# EAGLE design FotoMindARShield (EAGLE 6.3)
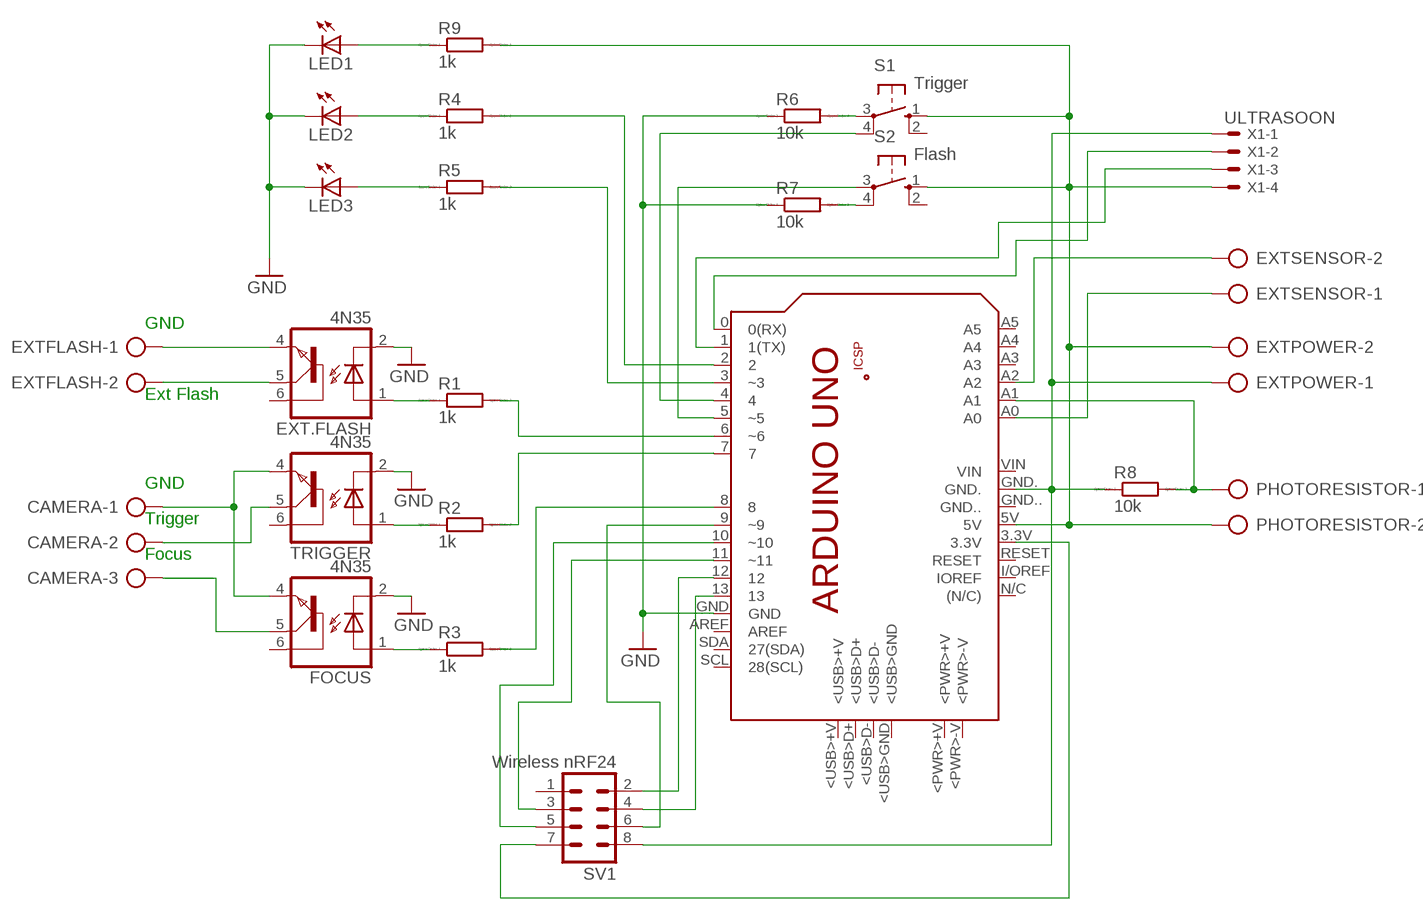
[diagram p0: schematic, sheet 1]

## Parts
CAMERA  AK300/3  [AK300/3]
EXT.FLASH  4N35  [DIL06]
EXTFLASH  AK300/2  [AK300/2]
EXTPOWER  AK300/2  [AK300/2]
EXTSENSOR  AK300/2  [AK300/2]
FOCUS  4N35  [DIL06]
LED1  LED3MM  [LED3MM]
LED2  LED3MM  [LED3MM]
LED3  LED3MM  [LED3MM]
PCB1  ARDUINO_UNO  [ARDUINO_UNO]
PHOTORESISTOR  AK300/2  [AK300/2]
R1  1k  R0204/7  [0204/7]
R2  1k  R0204/7  [0204/7]
R3  1k  R0204/7  [0204/7]
R4  1k  R0204/7  [0204/7]
R5  1k  R0204/7  [0204/7]
R6  10k  R0204/7  [0204/7]
R7  10k  R0204/7  [0204/7]
R8  10k  R0204/7  [0204/7]
R9  1k  R0204/7  [0204/7]
S1  Trigger  10-XX  [B3F-10XX]
S2  Flash  10-XX  [B3F-10XX]
SV1  Wireless nRF24  MA04-2  [MA04-2]
TRIGGER  4N35  [DIL06]
X1  ULTRASOON  22-23-2041  [22-23-2041]

## Nets
GND: EXT.FLASH.2(C) FOCUS.2(C) LED1.K(C) LED2.K(C) LED3.K(C) PCB1.GND R6.1 R7.1 TRIGGER.2(C)
N$1: EXT.FLASH.1(A) R1.1
N$2: R2.1 TRIGGER.1(A)
N$3: FOCUS.1(A) R3.1
N$4: PCB1.6(~6) R1.2
N$5: PCB1.7 R2.2
N$6: PCB1.8 R3.2
N$7: PCB1.2 R4.2
N$8: PCB1.3(~3) R5.2
N$9: LED3.A R5.1
N$10: LED2.A R4.1
N$11: EXT.FLASH.4(EMI) EXTFLASH.1
N$12: EXT.FLASH.5(COL) EXTFLASH.2
N$13: CAMERA.1 FOCUS.4(EMI) TRIGGER.4(EMI)
N$14: CAMERA.2 TRIGGER.5(COL)
N$15: CAMERA.3 FOCUS.5(COL)
N$16: PCB1.4 S1.4(P1)
N$17: PCB1.5(~5) S2.3(P)
N$18: R6.2 S1.3(P)
N$20: R7.2 S2.4(P1)
N$21: EXTPOWER.1 PCB1.GND. R8.1 SV1.8 X1.1
N$22: PCB1.A1 PHOTORESISTOR.1 R8.2
N$23: PCB1.12 SV1.2
N$24: PCB1.11(~11) SV1.3
N$25: PCB1.13 SV1.4
N$26: PCB1.10(~10) SV1.5
N$27: PCB1.9(~9) SV1.6
N$28: EXTSENSOR.1 PCB1.A0
N$29: EXTSENSOR.2 PCB1.A2
N$30: PCB1.3.3V SV1.7
N$79: EXTPOWER.2 PCB1.5V PHOTORESISTOR.2 R9.2 S1.1(S) S2.1(S) X1.4
N$92: LED1.A R9.1
N$105: PCB1.1(1(TX)) X1.3
N$106: PCB1.0(0(RX)) X1.2
Unconnected: EXT.FLASH.6(BAS) FOCUS.6(BAS) PCB1.+5V PCB1.<PWR>+V PCB1.<PWR>-V PCB1.<USB>+V PCB1.<USB>D+ PCB1.<USB>D- PCB1.<USB>GND PCB1.A3 PCB1.A4 PCB1.A5 PCB1.AREF PCB1.GND.. PCB1.GND_ PCB1.I/OREF(IOREF) PCB1.MISO PCB1.MOSI PCB1.N/C((N/C)) PCB1.RESET PCB1.RESET. PCB1.SCK PCB1.SCL(28(SCL)) PCB1.SDA(27(SDA)) PCB1.VIN S1.2(S1) S2.2(S1) SV1.1 TRIGGER.6(BAS)

## Notes on the sheet
- GND
- Ext Flash
- GND
- Trigger
- Focus

## Library data of the parts
CAMERA = con-ptr500:AK300/3: CONNECTOR; OC_FARNELL: unknown; OC_NEWARK: unknown
EXT.FLASH FOCUS TRIGGER = optocoupler:4N35: MOTOROLA OPTO COUPLER; MF: FAIRCHILD SEMICONDUCTOR; MPN: 4N35; OC_FARNELL: 1328375; OC_NEWARK: 72K9946
EXTFLASH EXTPOWER EXTSENSOR PHOTORESISTOR = con-ptr500:AK300/2: CONNECTOR; OC_FARNELL: unknown; OC_NEWARK: unknown
LED1-LED3 = led:LED: LED OSRAM: - CHIPLED LG R971, LG N971, LY N971, LG Q971, LY Q971, LO R971, LY R971 LH N974, LH R974 LS Q976, LO Q976, LY Q976 LO Q996 - Hyper CHIPLED LW Q18S LB Q993, LB Q99A, LB R99A - SideLED LS A670, LO A670, LY A670, LG A670, LP A670 LB A673, LV A673, LT A673, LW A673 LH A674 LY A675 LS A676, LA A676, LO A676, LY A676, LW A676 LS A679, LY A679, LG A679 - Hyper Micro SIDELED® LS Y876, LA Y876, LO Y876, LY Y876 LT Y87S - SmartLED LW L88C, LW L88S LB L89C, LB L89S, LG L890 LS L89K, LO L89K, LY L89K LS L896, LA L896, LO L896, LY L896 - TOPLED LS T670, LO T670, LY T670, LG T670, LP T670 LSG T670, LSP T670, LSY T670, LOP T670, LYG T670 LG T671, LOG T671, LSG T671 LB T673, LV T673, LT T673, LW T673 LH T674 LS T676, LA T676, LO T676, LY T676, LB T676, LH T676, LSB T676, LW T676 LB T67C, LV T67C, LT T67C, LS T67K, LO T67K, LY T67K, LW E67C LS E67B, LA E67B, LO E67B, LY E67B, LB E67C, LV E67C, LT E67C LW T67C LS T679, LY T679, LG T679 LS T770, LO T770, LY T770, LG T770, LP T770 LB T773, LV T773, LT T773, LW T773 LH T774 LS E675, LA E675, LY E675, LS T675 LS T776, LA T776, LO T776, LY T776, LB T776 LHGB T686 LT T68C, LB T68C - Hyper Mini TOPLED® LB M676 - Mini TOPLED Santana® LG M470 LS M47K, LO M47K, LY M47K Source: http://www.osram.convergy.de LUXEON: - LUMILED® LXK2-PW12-R00, LXK2-PW12-S00, LXK2-PW14-U00, LXK2-PW14-V00 LXK2-PM12-R00, LXK2-PM12-S00, LXK2-PM14-U00 LXK2-PE12-Q00, LXK2-PE12-R00, LXK2-PE12-S00, LXK2-PE14-T00, LXK2-PE14-U00 LXK2-PB12-K00, LXK2-PB12-L00, LXK2-PB12-M00, LXK2-PB14-N00, LXK2-PB14-P00, LXK2-PB14-Q00 LXK2-PR12-L00, LXK2-PR12-M00, LXK2-PR14-Q00, LXK2-PR14-R00 LXK2-PD12-Q00, LXK2-PD12-R00, LXK2-PD12-S00 LXK2-PH12-R00, LXK2-PH12-S00 LXK2-PL12-P00, LXK2-PL12-Q00, LXK2-PL12-R00 Source: www.luxeon.com KINGBRIGHT: KA-3528ASYC Source: www.kingbright.com
PCB1 = E14_Arduino_published:ARDUINO_UNO: Device for representing an Arduino Uno board with a footprint in an EAGLE design. Created by Dave Young for Element14. More EAGLE documentation at: http://www.element14.com/community/community/knode/cadsoft_eagle
R1-R9 = eagle-ltspice:R: RESISTOR, European symbol; SPICEMODEL: NONE; SPICEPREFIX: R
S1 S2 = switch-omron:10-XX: OMRON SWITCH; MPN: B3F-1000; OC_FARNELL: 176432; OC_NEWARK: 36M3542
SV1 = con-lstb:MA04-2: PIN HEADER; OC_FARNELL: unknown; OC_NEWARK: unknown
X1 = con-molex:22-23-2041: .100" (2.54mm) Center Header - 4 Pin; MF: MOLEX; MPN: 22-23-2041; OC_FARNELL: 1462920; OC_NEWARK: 38C0355

## Board
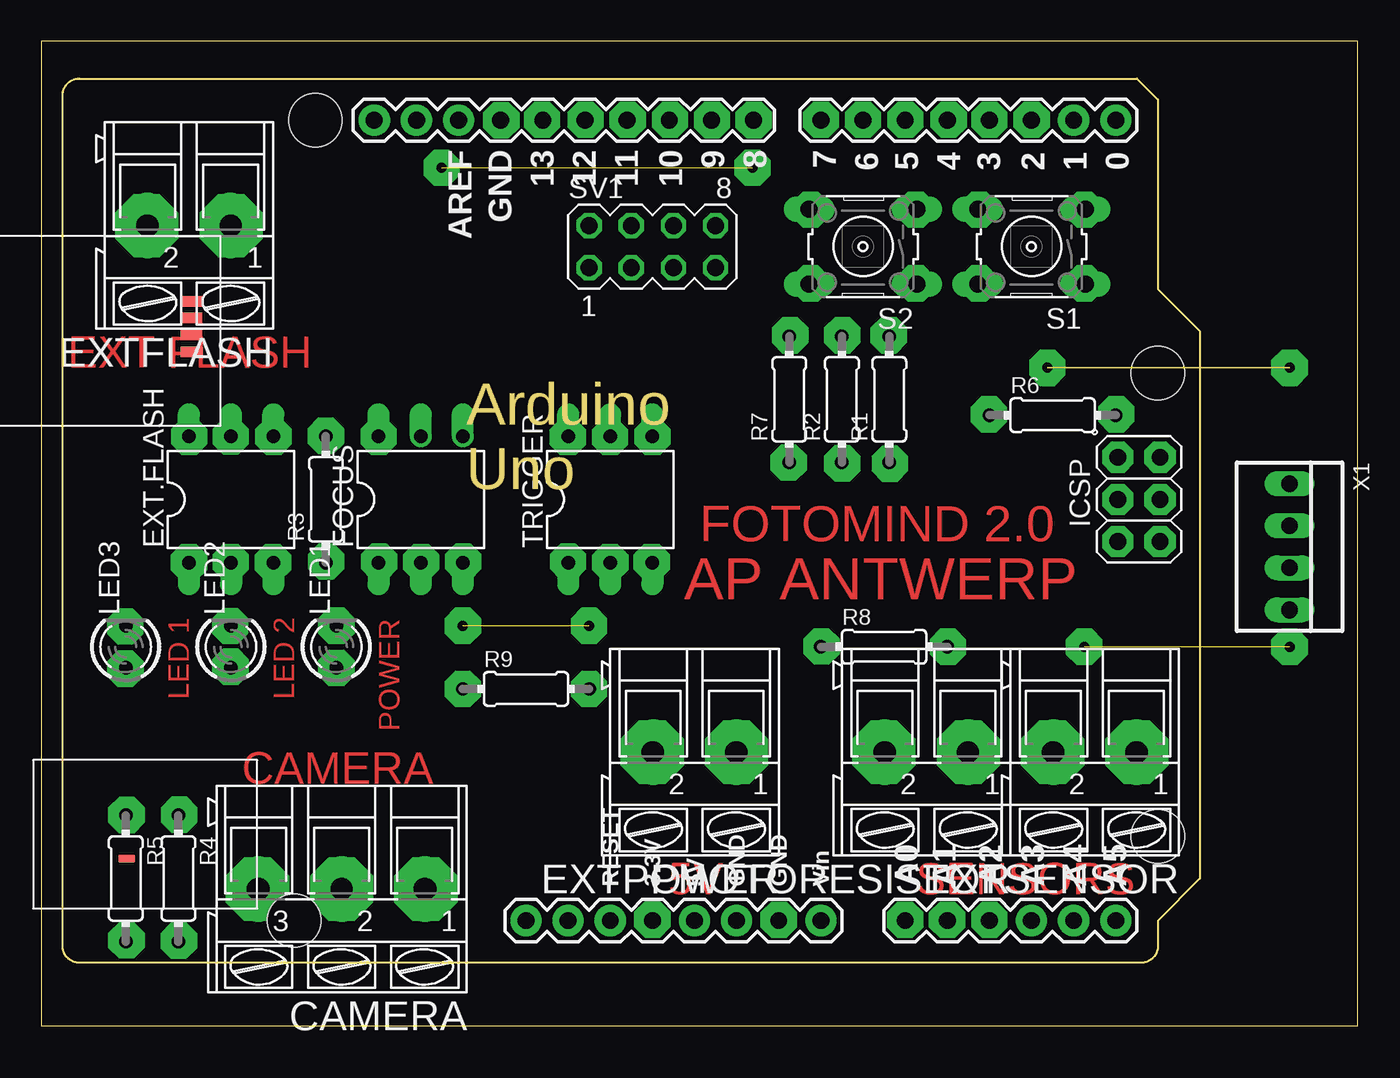
[diagram p1: board, top side]
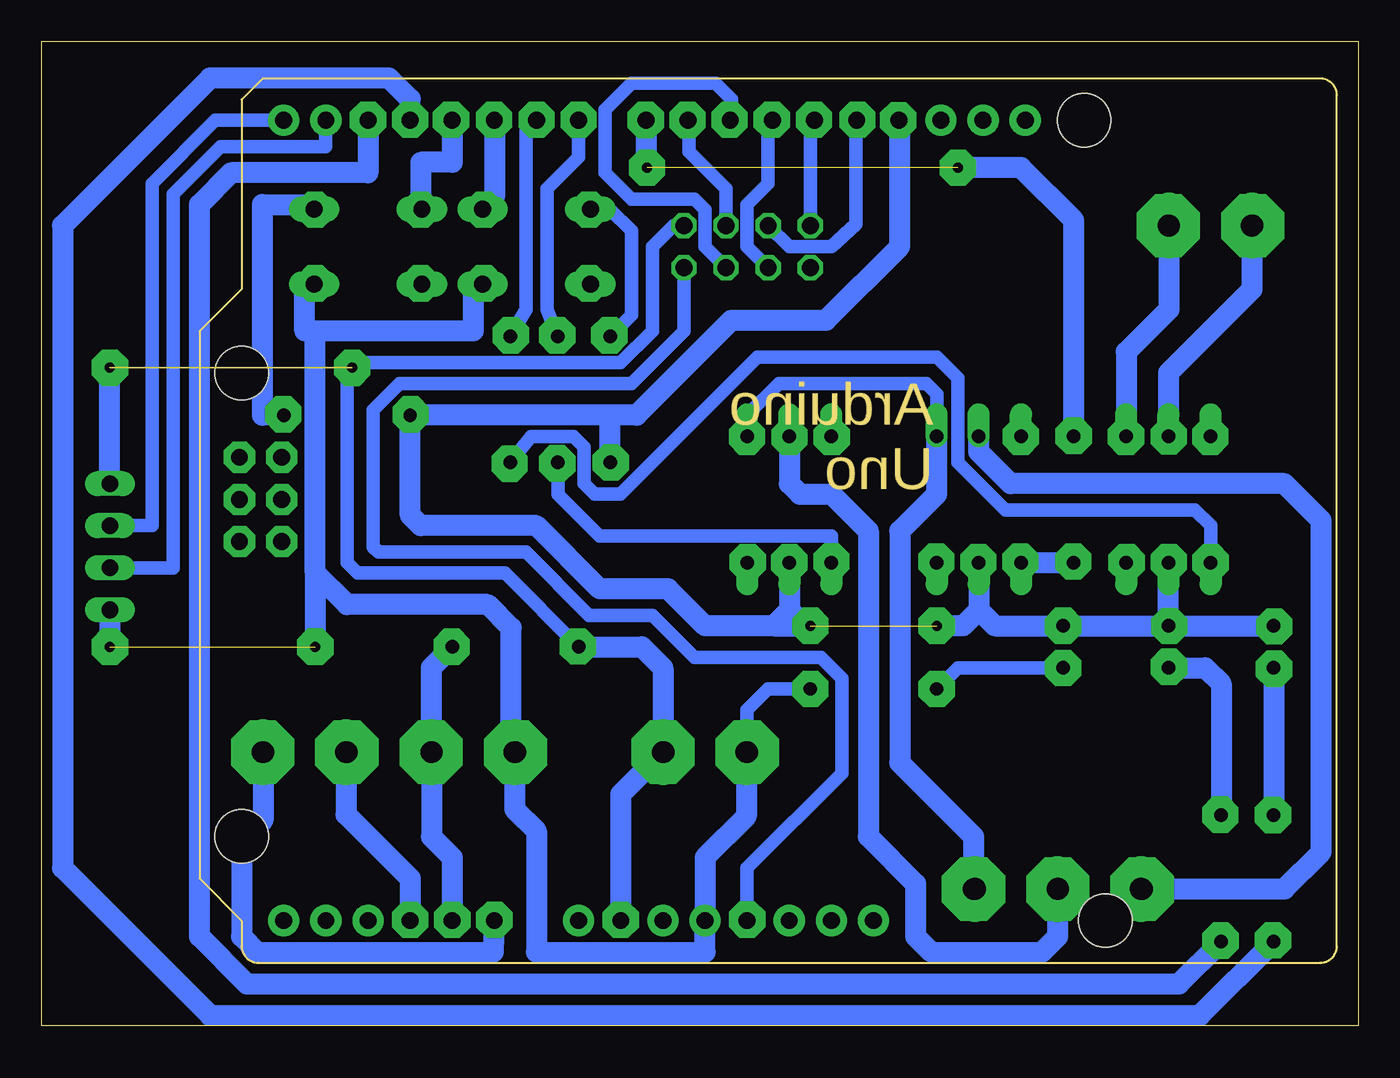
[diagram p2: board, bottom side, seen from below]

Size 79.36 x 59.36 mm. Coordinates in mm from the lower left corner, seen from the top.
Outline: 0,0 79.36,0 79.36,59.36 0,59.36 0,0
Copper layers (1*16): Top 0.035mm / dielectric 1.5mm / Bottom 0.035mm
Design rules "default": minimum track width 10mil, minimum drill 24mil, track to track 8mil, track to pad 8mil, pad to pad 8mil, via to via 8mil, smd to smd 8mil, copper to edge 40mil, drill to drill 8mil, minimum pad ring 10mil, minimum via ring 8mil, stop-mask expansion 4mil, vias tented up to drill 0mil, thermal gap 10mil

### Footprints (pad centres in the part's own frame; a part is rotated, then mirrored left to right if it is on the bottom)
AK300/3 = drill 1.321 long: 1 -5.004,0; 2 0,0; 3 5.004,0
DIL06 = drill 0.813 offset: 1 -2.54,-3.81; 2 0,-3.81; 3 2.54,-3.81; 4 2.54,3.81; 5 0,3.81; 6 -2.54,3.81
AK300/2 = drill 1.321 long: 1 -2.515,0; 2 2.489,0
LED3MM = drill 0.813 octagon: A -1.27,0; K 1.27,0
ARDUINO_UNO = drill 1.016 pad 1.88: 0 63.5,50.8; 1 60.96,50.8; 2 58.42,50.8; 3 55.88,50.8; 3.3V 35.56,2.54; 4 53.34,50.8; 5 50.8,50.8; 5V 38.1,2.54; 6 48.26,50.8; 7 45.72,50.8; 8 41.656,50.8; 9 39.116,50.8; 10 36.576,50.8; 11 34.036,50.8; 12 31.496,50.8; 13 28.956,50.8; A0 50.8,2.54; A1 53.34,2.54; A2 55.88,2.54; A3 58.42,2.54; A4 60.96,2.54; A5 63.5,2.54; AREF 23.876,50.8; GND 26.416,50.8; GND. 43.18,2.54; GND.. 40.64,2.54; I/OREF 30.48,2.54; N/C 27.94,2.54; RESET 33.02,2.54; SCL 18.796,50.8; SDA 21.336,50.8; VIN 45.72,2.54 | drill 1.016 pad 1.88 octagon: +5V 66.167,30.48; GND_ 66.167,25.4; MISO 63.627,30.48; MOSI 66.167,27.94; RESET. 63.627,25.4; SCK 63.627,27.94 | smd 1.016 x 0.508: <PWR>+V 3.861,8.814; <PWR>-V 3.861,6.274 | smd 1.27 x 0.635: <USB>+V 7.772,39.878; <USB>D+ 7.772,38.887; <USB>D- 7.772,37.871; <USB>GND 7.772,36.83 | hole 3.2: 66.04,7.62; 66.04,35.56; 15.24,50.8; 13.97,2.54
0204/7 = drill 0.813 octagon: 1 -3.81,0; 2 3.81,0
B3F-10XX = drill 1.016 long: 1 -3.251,2.261; 2 3.251,2.261; 3 -3.251,-2.261; 4 3.251,-2.261
MA04-2 = drill 1.016 octagon: 1 -3.81,-1.27; 2 -3.81,1.27; 3 -1.27,-1.27; 4 -1.27,1.27; 5 1.27,-1.27; 6 1.27,1.27; 7 3.81,-1.27; 8 3.81,1.27
22-23-2041 = drill 1 long: 1 -3.81,0; 2 -1.27,0; 3 1.27,0; 4 3.81,0

### Placement (x,y rotation side)
CAMERA  18.1,8.26 180 top
EXT.FLASH  11.43,31.75 0 top
EXTFLASH  8.89,48.26 180 top
EXTPOWER  39.37,16.51 180 top
EXTSENSOR  63.5,16.51 180 top
FOCUS  22.86,31.75 0 top
LED1  17.78,22.86 90 top
LED2  11.43,22.86 90 top
LED3  5.08,22.86 90 top
PCB1  1.27,3.81 0 top
PHOTORESISTOR  53.34,16.51 180 top
R1  51.12,37.78 90 top
R2  48.26,37.78 90 top
R3  17.14,31.75 90 top
R4  8.26,8.89 270 top
R5  5.08,8.89 270 top
R6  60.96,36.83 0 top
R7  45.09,37.78 90 top
R8  50.8,22.86 0 top
R9  29.21,20.32 0 top
S1  59.69,46.99 180 top
S2  49.53,46.99 180 top
SV1  36.83,46.99 0 top
TRIGGER  34.29,31.75 0 top
X1  75.25,28.89 270 top

### Tracks (layer width: path | path; a pad name or v marks a point on that pad's centre or on a via)
GND  (1 unrouted)
  Bottom 1.27: LED2.K EXT.FLASH.2 | LED2.K LED3.K | 27.94,54.36 PCB1.GND 27.62,54.55 27.62,46.99 32.07,42.55 37.78,42.55 43.5,36.83 45.09,36.83 | 45.09,36.83 R6.1 57.15,30.8 56.52,30.16 49.53,30.16 45.72,26.35 41.59,26.35 39.37,24.13 35.24,24.13 | R7.1 45.09,36.83 | 22.86,25.08 21.91,24.13 LED1.K LED2.K | FOCUS.2 22.86,25.08 | 22.86,25.08 23.81,24.13 25.4,24.13 | 33.34,24.13 34.29,25.08 | TRIGGER.2 34.29,25.08 | 34.29,25.08 35.24,24.13 | 33.34,24.13 33.02,24.13 | 35.24,24.13 33.34,24.13
N$1  (via drill 0.6 pad 2.18)
  Bottom 0.813: R1.1 49.85,35.54 47.31,35.54 46.67,34.91 46.67,32.7 46.04,32.07 44.45,32.07 36.2,40.32 25.4,40.32 24.13,39.05 24.13,33.97 21.27,31.11 9.84,31.11 8.89,30.16 v8.89,27.96 EXT.FLASH.1
N$2  (via drill 0.6 pad 2.18)
  Bottom 0.813: TRIGGER.1 v31.75,27.99 31.75,29.53 45.72,29.53 48.24,32.05 R2.1
N$3
  Bottom 1.27: FOCUS.1 R3.1
N$4
  Bottom 0.813: PCB1.6 50.16,53.98 50.16,43.18 R1.2
N$5
  Bottom 0.813: PCB1.7 46.99,52.39 48.9,50.48 48.9,43.18 R2.2
N$6  (via drill 0.6 pad 2.18)  (1 unrouted)
  Bottom 1.27: R3.2 v17.14,35.58 17.14,48.58 20.32,51.75 v24.13,51.75 | PCB1.8 42.93,51.82 42.86,51.75
N$7
  Bottom 1.27: R4.2 10.79,2.54 66.99,2.54 69.85,5.4 69.85,49.53 67.94,51.44 59.69,51.44 PCB1.2
N$8  (via drill 0.6 pad 2.18)
  Bottom 1.27: PCB1.3 v57.15,54.65 57.15,55.88 58.42,57.15 69.22,57.15 78.11,48.26 78.11,9.53 69.22,0.64 67.63,0.64 67.31,0.64 9.53,0.64 R5.2
N$9
  Bottom 1.27: LED3.A R5.1
N$10
  Bottom 1.27: LED2.A 9.21,21.59 8.26,20.64 R4.1
N$11
  Bottom 1.27: EXTFLASH.1 11.4,43.2 13.97,40.64 EXT.FLASH.4
N$12
  Bottom 1.27: EXTFLASH.2 6.4,44.4 11.43,39.37 EXT.FLASH.5
N$13
  Bottom 0.813: FOCUS.4 25.4,38.1 26.04,38.73 34.92,38.73 36.83,36.83 TRIGGER.4
  Bottom 1.27: CAMERA.1 23.18,8.33 23.18,11.43 27.62,15.88 27.62,29.84 25.4,32.07 FOCUS.4
N$14
  Bottom 1.27: TRIGGER.5 34.29,32.7 33.66,32.07 31.75,32.07 29.53,29.84 29.53,11.43 26.67,8.57 26.67,5.4 25.72,4.45 19.05,4.45 18.1,5.4 CAMERA.2
N$15  (via drill 1.3 pad 3.81)
  Bottom 1.27: CAMERA.3 v13.02,8.26 4.45,8.26 2.22,10.48 2.22,30.48 4.45,32.7 20.95,32.7 22.86,34.61 FOCUS.5
N$16
  Bottom 1.27: PCB1.4 54.61,52.07 56.52,52.07 56.52,49.96 S1.4
N$17
  Bottom 1.27: PCB1.5 52.07,49.96 S2.3
N$18
  Bottom 1.27: R6.2 66.04,36.83 66.04,49.53 63.22,49.53 S1.3
N$19  (via drill 0.6 pad 2.18)
  other vias: 17.78,21.59
N$20
  Bottom 0.813: R7.2 43.81,42.86 43.81,47.94 45.09,49.21 46.24,49.21 S2.4
N$21  (via drill 0.6 pad 2.18, 1.3 pad 3.81)  (2 unrouted)
  Bottom 0.813: SV1.8 41.27,48.26 42.55,46.99 42.55,41.91 44.45,40.01 60.33,40.01 v60.64,39.69 60.96,39.37 60.96,27.94 60.33,27.3 51.44,27.3 R8.1
  Bottom 1.27: PCB1.GND. 44.45,13.97 v41.91,16.51 EXTPOWER.1 41.91,16.54 41.91,21.59 43.18,22.86 R8.1 | X1.1 75.25,39.69
N$22
  Bottom 1.27: PCB1.A1 54.61,10.16 55.85,11.4 PHOTORESISTOR.1 55.88,16.54 55.88,21.59 R8.2
N$23
  Bottom 0.813: SV1.2 33.02,54.36 PCB1.12
N$24
  Bottom 0.813: SV1.3 36.83,46.99 36.83,49.53 35.56,50.8 35.56,54.36 PCB1.11
N$25
  Bottom 0.813: SV1.4 34.29,46.99 31.75,46.99 30.28,48.36 30.28,54.46 PCB1.13
N$26
  Bottom 0.813: SV1.5 39.37,46.99 39.37,49.21 40.01,49.85 43.81,49.85 45.4,51.44 45.4,55.24 43.81,56.83 38.73,56.83 37.78,55.88 37.78,54.67 PCB1.10
N$27
  Bottom 0.813: SV1.6 38.1,50.48 40.32,52.7 40.32,54.55 PCB1.9
N$28  (via drill 0.6 pad 2.18)
  Bottom 1.27: EXTSENSOR.1 66.02,12.41 67.31,11.11 67.31,5.4 66.36,4.45 52.12,4.45 v52.07,6.4 PCB1.A0
N$29
  Bottom 1.27: EXTSENSOR.2 61.01,12.75 57.15,8.89 PCB1.A2
N$30
  Bottom 0.813: SV1.7 40.64,41.91 43.81,38.73 57.78,38.73 59.37,37.15 59.37,28.89 59.05,28.57 50.16,28.57 46.35,24.77 42.55,24.77 40.01,22.23 32.38,22.23 31.11,20.95 31.11,15.24 36.83,9.53 PCB1.3.3V
N$31  (via drill 0.6 pad 2.18)
  other vias: 42.86,51.75
N$32  (via drill 0.6 pad 2.18)
  other vias: 25.4,24.13
N$33  (via drill 0.6 pad 2.18)
  other vias: 33.02,24.13
N$34  (via drill 0.6 pad 2.18)
  other vias: 45.05,33.97
N$35  (via drill 0.6 pad 2.18)
  other vias: 48.28,33.92
N$36  (via drill 0.6 pad 2.18)
  other vias: 51.15,33.9
N$37  (via drill 0.6 pad 2.18)
  other vias: 57.12,36.88
N$38  (via drill 0.6 pad 2.18)
  other vias: 48.28,41.65
N$39  (via drill 0.6 pad 2.18)
  other vias: 51.08,41.65
N$40  (via drill 0.6 pad 2.18)
  other vias: 45.14,41.65
N$41  (via drill 0.6 pad 2.18)
  other vias: 64.81,36.88
N$42  (via drill 0.6 pad 2.18)
  other vias: 47.04,22.88
N$43  (via drill 0.6 pad 2.18)
  other vias: 54.65,22.86
N$44  (via drill 0.6 pad 2.18)
  other vias: 5.04,24.08
N$45  (via drill 0.6 pad 2.18)
  other vias: 5.06,21.54
N$46  (via drill 0.6 pad 2.18)
  other vias: 11.38,24.11
N$47  (via drill 0.6 pad 2.18)
  other vias: 11.39,21.66
N$48  (via drill 0.6 pad 2.18)
  other vias: 17.16,28
N$49  (via drill 0.6 pad 2.18)
  other vias: 5.13,12.72
N$50  (via drill 0.6 pad 2.18)
  other vias: 5.13,5.16
N$51  (via drill 0.6 pad 2.18)
  other vias: 8.29,5.14
N$52  (via drill 0.6 pad 2.18)
  other vias: 8.3,12.73
N$53  (via drill 0.6 pad 2.18)
  other vias: 36.83,6.42
N$54  (via drill 0.6 pad 2.18)
  other vias: 44.45,6.4
N$55  (via drill 0.6 pad 2.18)
  other vias: 54.61,6.4
N$56  (via drill 0.6 pad 2.18)
  other vias: 57.15,6.4
N$57  (via drill 0.6 pad 2.18)
  other vias: 59.69,54.65
N$58  (via drill 0.6 pad 2.18)
  other vias: 54.69,54.65
N$59  (via drill 0.6 pad 2.18)
  other vias: 52.09,54.65
N$60  (via drill 0.6 pad 2.18)
  other vias: 49.53,54.65
N$61  (via drill 0.6 pad 2.18)
  other vias: 46.99,54.65
N$62  (via drill 0.6 pad 2.18)
  other vias: 42.95,54.63
N$63  (via drill 0.6 pad 2.18)
  other vias: 40.42,54.63
N$64  (via drill 0.6 pad 2.18)
  other vias: 37.9,54.65
N$65  (via drill 0.6 pad 2.18)
  other vias: 35.34,54.65
N$66  (via drill 0.6 pad 2.18)
  other vias: 32.8,54.65
N$67  (via drill 0.6 pad 2.18)
  other vias: 30.18,54.64
N$68  (via drill 0.6 pad 2.18)
  other vias: 27.72,54.61
N$69  (via drill 0.6 pad 2.18)
  other vias: 11.41,27.98
N$70  (via drill 0.6 pad 2.18)
  other vias: 13.95,27.96
N$71  (via drill 0.6 pad 2.18)
  other vias: 20.36,27.99
N$72  (via drill 0.6 pad 2.18)
  other vias: 22.89,27.98
N$73  (via drill 0.6 pad 2.18)
  other vias: 25.42,27.99
N$74  (via drill 0.6 pad 2.18)
  other vias: 34.29,27.96
N$75  (via drill 0.6 pad 2.18)
  other vias: 36.8,27.98
N$76  (via drill 0.6 pad 2.18)
  other vias: 36.85,35.52
N$77  (via drill 0.6 pad 2.18)
  other vias: 34.27,35.51
N$78  (via drill 0.6 pad 2.18)
  other vias: 31.73,35.51
N$79  (via drill 0.6 pad 2.18)  (1 unrouted)
  Bottom 0.813: R9.2 35.56,20.32 36.83,19.05 36.83,16.56 EXTPOWER.2
  Bottom 1.27: S2.1 53.06,44.73 53.34,44.45 53.34,41.91 62.87,41.91 | 62.87,41.91 63.5,41.91 63.5,44.17 S1.1 | EXTPOWER.2 36.88,12.65 39.37,10.16 PCB1.5V 39.37,4.45 49.53,4.45 49.53,11.75 50.85,13.07 PHOTORESISTOR.2 51.05,16.71 51.05,24 52.45,25.4 60.96,25.4 62.87,27.3 | 62.87,27.3 62.87,41.91 | 62.87,27.3 v62.87,22.86 | X1.4 75.25,22.86
N$80  (via drill 0.6 pad 2.18)
  other vias: 20.32,35.52
N$81  (via drill 0.6 pad 2.18)
  other vias: 13.99,35.52
N$82  (via drill 0.6 pad 2.18)
  other vias: 11.41,35.54
N$83  (via drill 0.6 pad 2.18)
  other vias: 8.91,35.52
N$84  (via drill 0.6 pad 2.18)
  other vias: 46.35,49.21
N$85  (via drill 0.6 pad 2.18)
  other vias: 46.35,44.77
N$86  (via drill 0.6 pad 2.18)
  other vias: 52.7,44.77
N$87  (via drill 0.6 pad 2.18)
  other vias: 52.7,49.21
N$88  (via drill 0.6 pad 2.18)
  other vias: 56.52,49.21
N$89  (via drill 0.6 pad 2.18)
  other vias: 56.52,44.77
N$90  (via drill 0.6 pad 2.18)
  other vias: 62.87,44.77
N$91  (via drill 0.6 pad 2.18)
  other vias: 62.87,49.21
N$92
  Bottom 0.813: LED1.A 24.13,21.59 R9.1
N$93  (via drill 0.6 pad 2.18)
  other vias: 17.78,24.13
N$94  (via drill 0.6 pad 2.18)
  other vias: 25.4,20.32
N$95  (via drill 0.6 pad 2.18)
  other vias: 33.02,20.32
N$96  (via drill 1.3 pad 3.81)
  other vias: 6.35,48.26
N$97  (via drill 1.3 pad 3.81)
  other vias: 11.43,48.26
N$98  (via drill 1.3 pad 3.81)
  other vias: 18.1,8.26
N$99  (via drill 1.3 pad 3.81)
  other vias: 23.18,8.26
N$100  (via drill 1.3 pad 3.81)
  other vias: 36.83,16.51
N$101  (via drill 1.3 pad 3.81)
  other vias: 50.8,16.51
N$102  (via drill 1.3 pad 3.81)
  other vias: 55.88,16.51
N$103  (via drill 1.3 pad 3.81)
  other vias: 60.96,16.51
N$104  (via drill 1.3 pad 3.81)
  other vias: 66.04,16.51
N$105
  Bottom 0.813: PCB1.1 62.23,53.02 68.58,53.02 71.44,50.16 71.44,27.62 X1.3
N$106
  Bottom 0.813: PCB1.0 68.9,54.61 72.71,50.8 72.71,30.16 X1.2
N$107  (via drill 0.6 pad 2.18)
  other vias: 75.25,39.69
N$108  (via drill 0.6 pad 2.18)
  other vias: 75.25,22.86

### Text on the board
Top: EXT FLASH | FOTOMIND 2.0 | AP ANTWERP | LED 1 | LED 2 | POWER | CAMERA | 5V | SENSORS